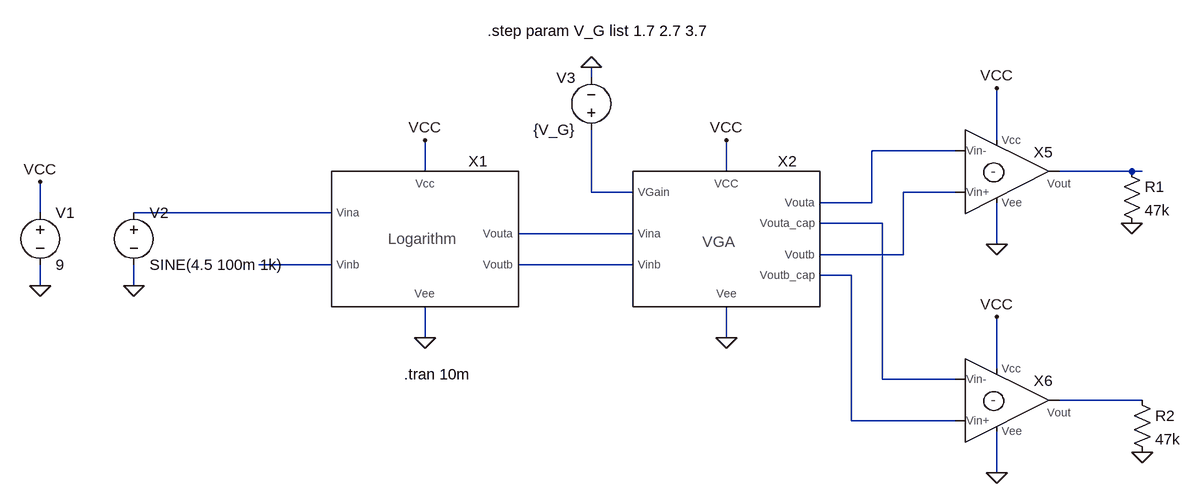
[diagram p0: schematic ModelSteilheitsmultiplizierer.asc]
ModelSteilheitsmultiplizierer.asc, the LTspice schematic file:
Version 4
SHEET 1 1268 680
WIRE 352 -64 352 -80
WIRE 976 32 976 -48
WIRE 912 48 784 48
WIRE 96 80 96 32
WIRE 560 80 560 32
WIRE 1184 80 1072 80
WIRE 1200 80 1184 80
WIRE 352 112 352 16
WIRE 416 112 352 112
WIRE 912 112 832 112
WIRE 784 128 784 48
WIRE 784 128 704 128
WIRE -496 144 -496 96
WIRE -48 144 -352 144
WIRE 800 160 704 160
WIRE 416 176 240 176
WIRE 976 192 976 128
WIRE 832 208 832 112
WIRE 832 208 704 208
WIRE -48 224 -160 224
WIRE 416 224 240 224
WIRE 752 240 704 240
WIRE -496 256 -496 224
WIRE -352 256 -352 224
WIRE 96 336 96 288
WIRE 560 336 560 288
WIRE 976 384 976 304
WIRE 800 400 800 160
WIRE 912 400 800 400
WIRE 1200 432 1072 432
WIRE 752 464 752 240
WIRE 912 464 752 464
WIRE 976 544 976 480
FLAG -496 256 0
FLAG -496 96 VCC
FLAG 96 32 VCC
FLAG 560 32 VCC
FLAG 96 336 0
FLAG 560 336 0
FLAG -352 256 0
FLAG 352 -80 0
FLAG 976 192 0
FLAG 976 -48 VCC
FLAG 976 544 0
FLAG 976 304 VCC
FLAG 1184 160 0
FLAG 1200 512 0
SYMBOL Logarithmierer 32 160 R0
SYMATTR InstName X1
SYMBOL VariableGainAmplifier 560 176 R0
SYMATTR InstName X2
SYMATTR SpiceLine R_Gain =2k RC = 5k C_out = 10u
SYMBOL voltage -496 128 R0
WINDOW 123 0 0 Left 2
WINDOW 39 0 0 Left 2
SYMATTR InstName V1
SYMATTR Value 9
SYMBOL voltage -352 128 R0
WINDOW 123 0 0 Left 2
WINDOW 39 0 0 Left 2
SYMATTR InstName V2
SYMATTR Value SINE(4.5 100m 1k)
SYMBOL voltage 352 32 R180
WINDOW 0 24 96 Left 2
WINDOW 3 24 16 Left 2
WINDOW 123 0 0 Left 2
WINDOW 39 0 0 Left 2
SYMATTR InstName V3
SYMATTR Value {V_G}
SYMBOL res 1168 64 R0
SYMATTR InstName R1
SYMATTR Value 47k
SYMBOL res 1184 416 R0
SYMATTR InstName R2
SYMATTR Value 47k
SYMBOL Subtrahierer 992 80 R0
SYMATTR InstName X5
SYMBOL Subtrahierer 992 432 R0
SYMATTR InstName X6
TEXT 64 392 Left 2 !.tran 10m
TEXT 192 -136 Left 2 !.step param V_G list 1.7 2.7 3.7

The netlist it stands for:
* ModelSteilheitsmultiplizierer.asc
XX1 VCC 0 N005 N008 N007 N009 Logarithmierer  ; pins Vcc Vee Vina Vinb Vouta Voutb
XX2 VCC 0 N003 N007 N009 N001 N006 N004 N010 VariableGainAmplifier R_Gain =2k RC = 5k C_out = 10u  ; pins VCC Vee VGain Vina Vinb Vouta Vouta_cap Voutb Voutb_cap
V1 VCC 0 9
V2 N005 0 SINE(4.5 100m 1k)
V3 N003 0 {V_G}
R1 N002 0 47k
R2 N011 0 47k
XX5 VCC 0 N004 N001 N002 Subtrahierer  ; pins Vcc Vee Vin+ Vin- Vout
XX6 VCC 0 N010 N006 N011 Subtrahierer  ; pins Vcc Vee Vin+ Vin- Vout
.tran 10m
.step param V_G list 1.7 2.7 3.7
.backanno
.end